# Altium schematic sheet Fujin_Peripherals.SchDoc
size A4; SheetNumber: 2; SheetTotal: 4
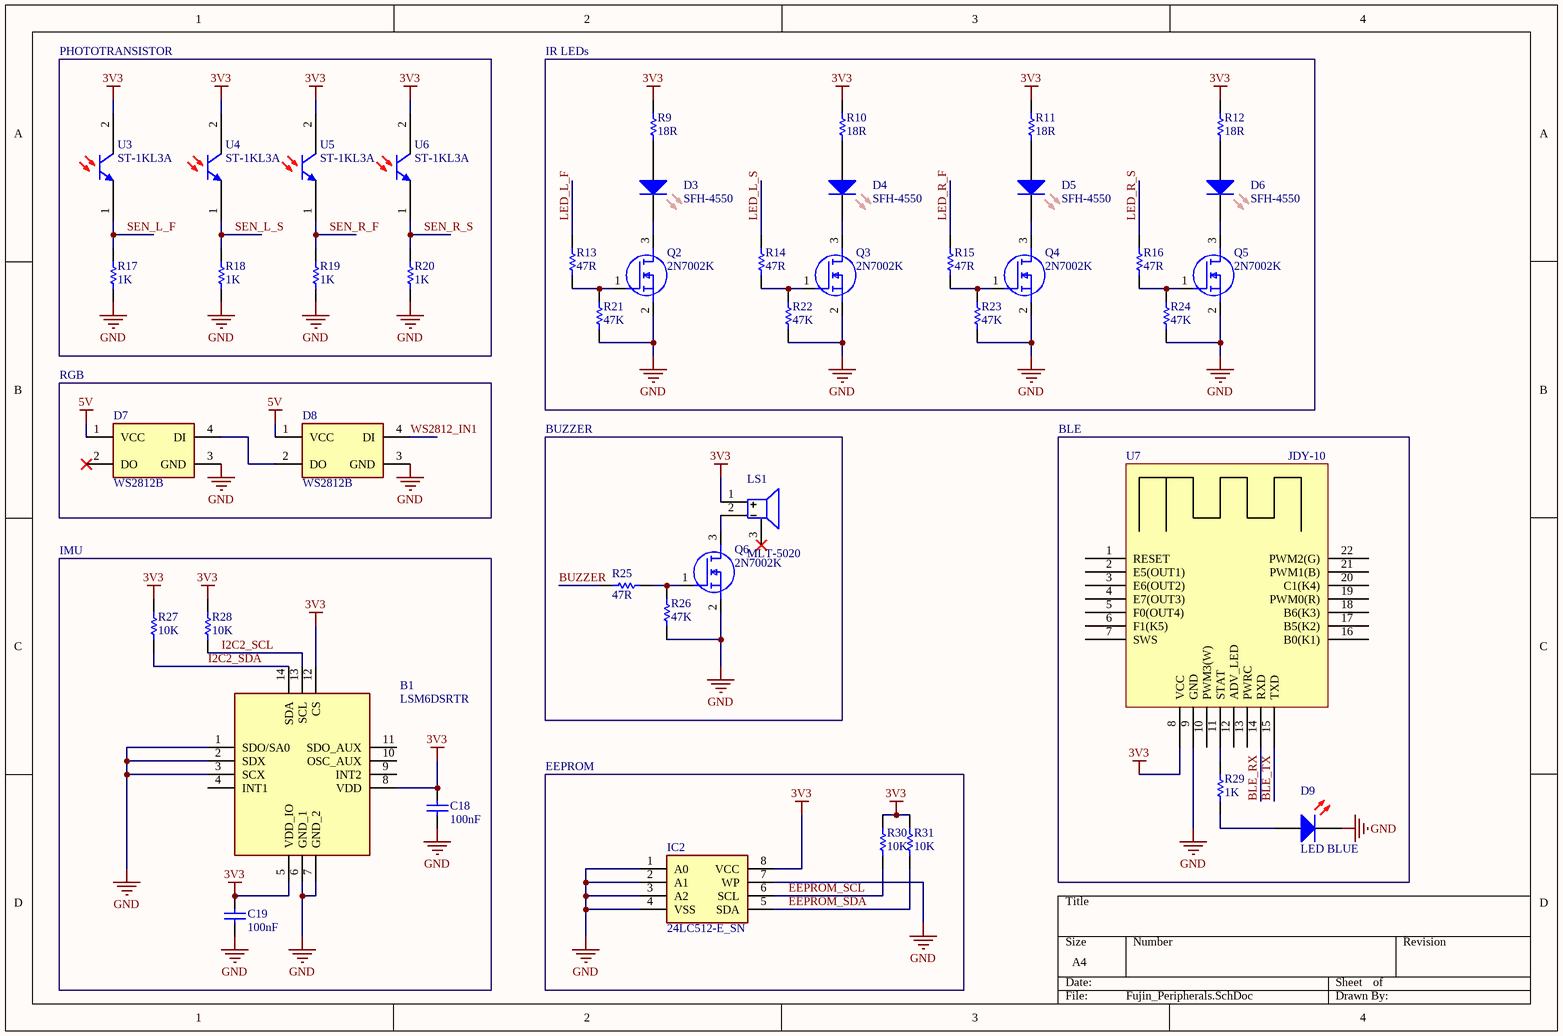
[diagram p0: Fujin_Peripherals.SchDoc]

## Parts
B1  LSM6DSRTR  [QFN50P300X250X86-14N]
C18  100nF  [CAP 0402]
C19  100nF  [CAP 0402]
D3  SFH-4550  [SFH-4550]
D4  SFH-4550  [SFH-4550]
D5  SFH-4550  [SFH-4550]
D6  SFH-4550  [SFH-4550]
D7  WS2812B  [WS2812B]
D8  WS2812B  [WS2812B]
D9  LED BLUE  [LED 0603]
IC2  24LC512-E_SN  [SOIC127P600X175-8N]
LS1  MLT-5020  [MLT-5020]
Q2  2N7002K  [SOT95P240X120-3N]
Q3  2N7002K  [SOT95P240X120-3N]
Q4  2N7002K  [SOT95P240X120-3N]
Q5  2N7002K  [SOT95P240X120-3N]
Q6  2N7002K  [SOT95P240X120-3N]
R9  18R  [RESISTOR 0603]
R10  18R  [RESISTOR 0603]
R11  18R  [RESISTOR 0603]
R12  18R  [RESISTOR 0603]
R13  47R  [RESISTOR 0603]
R14  47R  [RESISTOR 0603]
R15  47R  [RESISTOR 0603]
R16  47R  [RESISTOR 0603]
R17  1K  [RESISTOR 0603]
R18  1K  [RESISTOR 0603]
R19  1K  [RESISTOR 0603]
R20  1K  [RESISTOR 0603]
R21  47K  [RESISTOR 0603]
R22  47K  [RESISTOR 0603]
R23  47K  [RESISTOR 0603]
R24  47K  [RESISTOR 0603]
R25  47R  [RESISTOR 0603]
R26  47K  [RESISTOR 0603]
R27  10K  [RESISTOR 0402]
R28  10K  [RESISTOR 0402]
R29  1K  [RESISTOR 0603]
R30  10K  [RESISTOR 0402]
R31  10K  [RESISTOR 0402]
U3  ST-1KL3A  [ST-1KL3A]
U4  ST-1KL3A  [ST-1KL3A]
U5  ST-1KL3A  [ST-1KL3A]
U6  ST-1KL3A  [ST-1KL3A]
U7  JDY-10  [JDY-10 - Half]

## Blocks framed on the sheet
PHOTOTRANSISTOR: R17-R20 U3-U6
IR LEDs: D3-D6 Q2-Q5 R9-R16 R21-R24
RGB: D7 D8
BUZZER: LS1 Q6 R25 R26
BLE: D9 R29 U7
IMU: B1 C18 C19 R27 R28
EEPROM: IC2 R30 R31

## Nets
3V3: B1.5(VDD_IO) B1.8(VDD) B1.12(CS) C18.2 C19.2 IC2.8(VCC) LS1.1(+) R9.2 R10.2 R11.2 R12.2 R27.2 R28.2 R30.2 R31.2 U3.2(COLLECTOR) U4.2(COLLECTOR) U5.2(COLLECTOR) U6.2(COLLECTOR) U7.8(VCC)
5V: D7.1(VCC) D8.1(VCC)
GND: B1.1(SDO/SA0) B1.2(SDX) B1.3(SCX) B1.6(GND_1) B1.7(GND_2) C18.1 C19.1 D7.3(GND) D8.3(GND) D9.2(K) IC2.1(A0) IC2.2(A1) IC2.3(A2) IC2.4(VSS) IC2.7(WP) Q2.2(S) Q3.2(S) Q4.2(S) Q5.2(S) Q6.2(S) R17.1 R18.1 R19.1 R20.1 R21.1 R22.1 R23.1 R24.1 R26.1 U7.9(GND)
BLE_RX: U7.14(RXD)
BLE_TX: U7.15(TXD)
BUZZER: R25.1
EEPROM_SCL: IC2.6(SCL) R30.1
EEPROM_SDA: IC2.5(SDA) R31.1
I2C2_SCL: B1.13(SCL) R28.1
I2C2_SDA: B1.14(SDA) R27.1
LED_L_F: R13.2
LED_L_S: R14.2
LED_R_F: R15.2
LED_R_S: R16.2
SEN_L_F: R17.2 U3.1(EMITTER)
SEN_L_S: R18.2 U4.1(EMITTER)
SEN_R_F: R19.2 U5.1(EMITTER)
SEN_R_S: R20.2 U6.1(EMITTER)
WS2812_IN1: D8.4(DI)
NetD3_1: D3.1(A) R9.1
NetD3_2: D3.2(K) Q2.3(D)
NetD4_1: D4.1(A) R10.1
NetD4_2: D4.2(K) Q3.3(D)
NetD5_1: D5.1(A) R11.1
NetD5_2: D5.2(K) Q4.3(D)
NetD6_1: D6.1(A) R12.1
NetD6_2: D6.2(K) Q5.3(D)
NetD7_4: D7.4(DI) D8.2(DO)
NetD9_1: D9.1(A) R29.1
NetLS1_2: LS1.2(-) Q6.3(D)
NetQ2_1: Q2.1(G) R13.1 R21.2
NetQ3_1: Q3.1(G) R14.1 R22.2
NetQ4_1: Q4.1(G) R15.1 R23.2
NetQ5_1: Q5.1(G) R16.1 R24.2
NetQ6_1: Q6.1(G) R25.2 R26.2
NetR29_2: R29.2 U7.11(STAT)

Not connected (* = marked no-connect by the designer): B1 4(INT1) 9(INT2) 10(OSC_AUX) 11(SDO_AUX); D7 2(DO)*; LS1 3(DUMMY)*; U7 1(RESET) 2(E5(OUT1)) 3(E6(OUT2)) 4(E7(OUT3)) 5(F0(OUT4)) 6(F1(K5)) 7(SWS) 10(PWM3(W)) 12(ADV_LED) 13(PWRC) 16(B0(K1)) 17(B5(K2)) 18(B6(K3)) 19(PWM0(R)) 20(C1(K4)) 21(PWM1(B)) 22(PWM2(G))

## Library data of the parts
B1 = LSM6DSRTR: IMUs - Inertial Measurement Units; Manufacturer_Name: STMicroelectronics; Geometry.Height: 0.86mm; Manufacturer_Part_Number: LSM6DSRTR; Mouser Part Number: *; Mouser Price/Stock: *; Arrow Part Number: *; Arrow Price/Stock: *; Datasheet Link: https://componentsearchengine.com/Datasheets/2/LSM6DSRTR.pdf
C18 C19 = CAP 100NF 50V 0402: Capacitor Cer 100nF 50V 0402; Manufacturer Part Number: IMP14925; Product Range: MCFY Series; Capacitance: 0.1uF; Capacitance Tolerance: +80%, -20%; Dielectric Characteristic: Y5; Voltage Rating: 50; Capacitor Terminals: Radial Leaded; SVHC: No SVHC (15-Jun-2015); Supplier 1: Mult Comercial; Manufacturer: -; RoHS: YES; Stock 1: 115809; Pricing 1: 1=0.10 (BRL); Packaging: Each; Lead Spacing: 5; Operating Temperature Min: -25; Operating Temperature Max: 85; Capacitance Tolerance ±: +80%, -20%; Operating Temperature Range: -25°C to +85°C<!--FANDB--><div class="features-and-benefits-container"><div class="features-and-benefits-description"><span class="features-benefits-value">The MCFY series from Multicomp are radial leaded ceramic disc capacitors. The capacitance values ranges from 6800pF to 0.22?F.</span></div><div class="features-and-benefits-list"><ul class="features-and-benefits-list-list"><li class="features-and-benefits-list-item">Large capacitance in small size</li><li class="features-and-benefits-list-item">Rated voltage of 50V</li><li class="features-and-benefits-list-item">80%/-20% tolerance</li><li class="features-and-benefits-list-item">Operating temperature range -25°C to +85; ComponentLink1URL: http://loja.multcomercial.com.br/capacitor-ceramico-disco-100kpf-50v-104-100k-100nf-0-1uf-cod-1351.html; ComponentLink1Description: http://loja.multcomercial.com.br/capacitor-ceramico-disco-100kpf-50v-104-100k-100nf-0-1uf-cod-1351.html; Supplier Part Number 1: Capacitor Cerâmico Disco 100Kpf/50V (104/100K/100nF/0.1uF) cód. 1351
D3-D6 = SFH-4550: LED 5mm IR; Manufacturer: OSRAM; Bulb Size: 5mm; Datasheet: https://look.ams-osram.com/m/7d214b223a9adb85/original/SFH-4550.pdf
D7 D8 = WS2812B: Diode; Manufacturer_Name: Worldsemi; Manufacturer_Part_Number: WS2812; Datasheet Link: https://www.adafruit.com/datasheets/WS2812.pdf
D9 = LED RED 0603: LED; Manufacturer_Name: ROHM Semiconductor; Manufacturer_Part_Number: SML-D12U1WT86; Datasheet Link: https://componentsearchengine.com/Datasheets/1/SML-D12U1WT86.pdf; Height: 0.65mm; Mouser Part Number: 755-SML-D12U1WT86; Mouser Price/Stock: https://www.mouser.co.uk/ProductDetail/ROHM-Semiconductor/SML-D12U1WT86?qs=M3jcYzEJUdEySuGkbjHEtQ%3D%3D
IC2 = 24LC512-E_SN: Integrated Circuit; Manufacturer_Name: Microchip; Manufacturer_Part_Number: 24LC512-E/SN; Datasheet Link: http://www.microchip.com/mymicrochip/filehandler.aspx?ddocname=en546203; Height: 1.75mm; Mouser Part Number: 579-24LC512-E/SN; Mouser Price/Stock: https://www.mouser.co.uk/ProductDetail/Microchip-Technology/24LC512-E-SN?qs=CtbZ3JXzXSq04R8z3pTI3A%3D%3D; Arrow Part Number: 24LC512-E/SN; Arrow Price/Stock: https://www.arrow.com/en/products/24lc512-esn/microchip-technology?region=nac
LS1 = MLT-5020: Loudspeaker or Buzzer; Manufacturer_Name: PUI Audio; Manufacturer_Part_Number: SMT-0540-S-R; Datasheet Link: http://www.puiaudio.com/pdf/SMT-0540-S-R.pdf; Height: 2mm; Mouser Part Number: 665-SMT0540SR; Mouser Price/Stock: https://www.mouser.co.uk/ProductDetail/PUI-Audio/SMT-0540-S-R?qs=e16JbV5WBEu5VaDVzQP23Q%3D%3D; LCSC: Jiangsu Huaneng Elec MLT-5020; Link: https://www.lcsc.com/product-detail/Buzzers_Jiangsu-Huaneng-Elec-MLT-5020_C94598.html
Q2-Q6 = 2N7002K: MOSFET (N-Channel); Manufacturer_Name: onsemi; Datasheet Link: https://componentsearchengine.com/Datasheets/2/2N7002K.pdf; Height: 1.2mm; Manufacturer_Part_Number: 2N7002K; Mouser Part Number: 512-2N7002K; Mouser Price/Stock: https://www.mouser.co.uk/ProductDetail/onsemi-Fairchild/2N7002K?qs=iS%252BvaFGfLorx0keKeEIrfg%3D%3D; Arrow Part Number: 2N7002K; Arrow Price/Stock: https://www.arrow.com/en/products/2n7002k/on-semiconductor?region=nac
R9-R12 = RES 18R 5%: Manufacturer: Ty-Ohm; Manufacturer Part Number: CR25; Tolerance: ±5%; Power (Watts): 0.25W, 1/4W; Temperature Coefficient: 0/ -500ppm/°C; Supplier 1: Mult Comercial; RoHS: RoHS Compliant; Category: Resistors; Stock 1: 617543; Pricing 1: 1=0.20 (BRL); Packaging: Cut Tape (CT); Composition: Carbon Film; Features: Flame Retardant Coating, Safety; Operating Temperature: -55°C ~ 155°C; Package / Case: Axial; Supplier Device Package: Axial; Size / Dimension: 0.091" Dia x 0.256" L (2.30mm x 6.50mm); Height: -; Number of Terminations: 2; ComponentLink1URL: http://loja.multcomercial.com.br/resistor-de-1-4-de-watt-cr25-5-de-tolerancia.html; ComponentLink1Description: http://loja.multcomercial.com.br/resistor-de-1-4-de-watt-cr25-5-de-tolerancia.html; Supplier Part Number 1: Resistor de Filme de Carbono 1/4 de Watt CR25 5% de tolerância - 0.22R Ω à 10M Ω; Resistance (Ohms): 18R
R13-R16 R25 = RES 47R 5%: Manufacturer: Ty-Ohm; Manufacturer Part Number: CR25; Tolerance: ±5%; Power (Watts): 0.25W, 1/4W; Temperature Coefficient: 0/ -500ppm/°C; Resistance (Ohms): 470R; Supplier 1: Mult Comercial; RoHS: RoHS Compliant; Category: Resistors; Stock 1: 617543; Pricing 1: 1=0.20 (BRL); Packaging: Cut Tape (CT); Composition: Carbon Film; Features: Flame Retardant Coating, Safety; Operating Temperature: -55°C ~ 155°C; Package / Case: Axial; Supplier Device Package: Axial; Size / Dimension: 0.091" Dia x 0.256" L (2.30mm x 6.50mm); Height: -; Number of Terminations: 2; ComponentLink1URL: http://loja.multcomercial.com.br/resistor-de-1-4-de-watt-cr25-5-de-tolerancia.html; ComponentLink1Description: http://loja.multcomercial.com.br/resistor-de-1-4-de-watt-cr25-5-de-tolerancia.html; Supplier Part Number 1: Resistor de Filme de Carbono 1/4 de Watt CR25 5% de tolerância - 0.22R Ω à 10M Ω
R17-R20 R29 = RES 1K 5%: Manufacturer: Ty-Ohm; Manufacturer Part Number: CR25; Tolerance: ±5%; Power (Watts): 0.25W, 1/4W; Temperature Coefficient: 0/ -500ppm/°C; Supplier 1: Mult Comercial; RoHS: RoHS Compliant; Category: Resistors; Stock 1: 617543; Pricing 1: 1=0.20 (BRL); Packaging: Cut Tape (CT); Composition: Carbon Film; Features: Flame Retardant Coating, Safety; Operating Temperature: -55°C ~ 155°C; Package / Case: Axial; Supplier Device Package: Axial; Size / Dimension: 0.091" Dia x 0.256" L (2.30mm x 6.50mm); Height: -; Number of Terminations: 2; ComponentLink1URL: http://loja.multcomercial.com.br/resistor-de-1-4-de-watt-cr25-5-de-tolerancia.html; ComponentLink1Description: http://loja.multcomercial.com.br/resistor-de-1-4-de-watt-cr25-5-de-tolerancia.html; Supplier Part Number 1: Resistor de Filme de Carbono 1/4 de Watt CR25 5% de tolerância - 0.22R Ω à 10M Ω; Resistance (Ohms): ?
R21-R24 R26 = RES 47K 5%: Manufacturer: Ty-Ohm; Manufacturer Part Number: CR25; Tolerance: ±5%; Power (Watts): 0.25W, 1/4W; Temperature Coefficient: 0/ -500ppm/°C; Supplier 1: Mult Comercial; RoHS: RoHS Compliant; Category: Resistors; Stock 1: 617543; Pricing 1: 1=0.20 (BRL); Packaging: Cut Tape (CT); Composition: Carbon Film; Features: Flame Retardant Coating, Safety; Operating Temperature: -55°C ~ 155°C; Package / Case: Axial; Supplier Device Package: Axial; Size / Dimension: 0.091" Dia x 0.256" L (2.30mm x 6.50mm); Height: -; Number of Terminations: 2; ComponentLink1URL: http://loja.multcomercial.com.br/resistor-de-1-4-de-watt-cr25-5-de-tolerancia.html; ComponentLink1Description: http://loja.multcomercial.com.br/resistor-de-1-4-de-watt-cr25-5-de-tolerancia.html; Supplier Part Number 1: Resistor de Filme de Carbono 1/4 de Watt CR25 5% de tolerância - 0.22R Ω à 10M Ω
R27 R28 R30 R31 = RES 10K 5%: Manufacturer: PANASONIC ELECTRONIC COMPONENTS; Manufacturer Part Number: ERJ-3GEYJ103V; Tolerance: ±5%; Power (Watts): 0.1W, 1/10W; Temperature Coefficient: ±200ppm/°C; RoHS: YES; ComponentLink1URL: http://www.farnell.com/datasheets/1678796.pdf; ComponentLink1Description: http://www.farnell.com/datasheets/1678796.pdf; Category: Resistors; Packaging: Tape & Reel (TR); Resistance (Ohms): 10k; Composition: Thick Film; Features: Automotive AEC-Q200; Operating Temperature: -55°C ~ 155°C; Package / Case: 0603 (1608 Metric); Supplier Device Package: 0603; Size / Dimension: 0.063" L x 0.031" W (1.60mm x 0.80mm); Height: 0.022" (0.55mm); Number of Terminations: 2; ComponentLink2URL: http://industrial.panasonic.com/www-cgi/jvcr13pz.cgi?E+PZ+3+AOA0001+ERJ3GEYJ103V+7+WW; ComponentLink2Description: http://industrial.panasonic.com/www-cgi/jvcr13pz.cgi?E+PZ+3+AOA0001+ERJ3GEYJ103V+7+WW
U3-U6 = ST-1KL3A: Phototransistor; Manufacturer_Name: Kodenshi; Datasheet Link: https://www.kodenshi.co.jp/top/wp-content/uploads/2022/03/ST-1KL3A.pdf
U7 = JDY-10-Bluetooth: ComponentLink1Description: Datasheet; ComponentLink1URL: http://myosuploads3.banggood.com/products/20190515/20190515052519JDY-10M.pdf